# Altium schematic sheet FPGA_USB.SchDoc
size A4
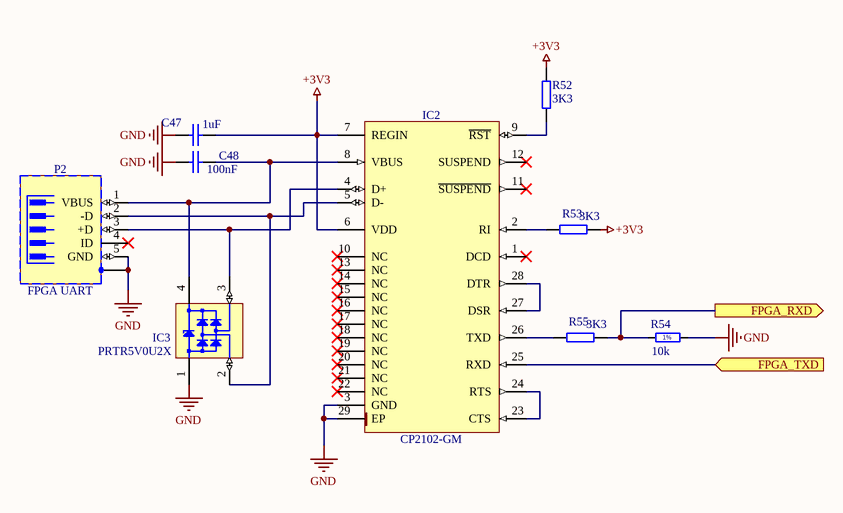
[diagram p0: FPGA_USB.SchDoc]

## Parts
C47  1uF  [CC1608-0603]
C48  100nF  [CAPC1608X87N]
IC2  CP2102-GM  [QFN50P500X500X100-29N-S335]
IC3  PRTR5V0U2X  [SOT190P230X110-4N]
P2  FPGA UART  [TYCO_1734035-1]
R52  3K3  [0603]
R53  3K3  [0603]
R54  10k  [RESC1608X55N]
R55  3K3  [0603]

## Ports
FPGA_RXD (out), FPGA_TXD (in)

## Nets
+3V3: C47.2 IC2.6(VDD) IC2.7(REGIN) R52.2 R53.2
GND: C47.1 C48.2 IC2.3(GND) IC2.29(EP) IC3.1(GND) P2.5(GND) P2.6(SH) R54.2
FPGA_RXD: R54.1 R55.2 ; port FPGA_RXD
FPGA_TXD: IC2.25(RXD) ; port FPGA_TXD
NetC48_1: C48.1 IC2.8(VBUS) IC3.4(VCC) P2.1(VBUS)
NetIC2_2: IC2.2(RI) R53.1
NetIC2_4: IC2.4(D+) IC3.3(I/O2) P2.3(+D)
NetIC2_5: IC2.5(D-) IC3.2(I/O1) P2.2(-D)
NetIC2_9: IC2.9(~{RST}) R52.1
NetIC2_23: IC2.23(CTS) IC2.24(RTS)
NetIC2_26: IC2.26(TXD) R55.1
NetIC2_27: IC2.27(DSR) IC2.28(DTR)

Not connected (* = marked no-connect by the designer): IC2 1(DCD)* 10(NC)* 11(~{SUSPEND})* 12(SUSPEND)* 13(NC)* 14(NC)* 15(NC)* 16(NC)* 17(NC)* 18(NC)* 19(NC)* 20(NC)* 21(NC)* 22(NC)*; P2 4(ID)*

## Notes on the sheet
- (in symbol R0603_10K_1%_0.1W_100PPM) 1%

## Library data of the parts
C47 = CC0603_1UF_25V_10%_X5R: Capacitor; Manufacturer1: Phycomp; Manufacturer1 PN: GRM188R61E105KA12D; TC: X5R; Tolerance: ±10%; Voltage: 25V; Published: 8-Jun-2000; LatestRevisionDate: 17-Jul-2002; LatestRevisionNote: Re-released for DXP Platform.; Publisher: Altium Limited; Distributor1: Digikey; Distributor1 PN: 490-3897-1-ND; Case: 0603; Value: 1uF
C48 = CC0603_100NF_50V_10%_X7R: Non-polarised capacitor; Part Description: SMD Multilayer Chip Ceramic Capacitor; Manufacturer: GENERIC; Manufacturer1 Part Number: 223858615649; Voltage: 50V; TC: X7R; Tolerance: ±10%; Table: Capacitors SMD; Part Number: CC0603_100NF_50V_10%_X7R; Component Kind: Standard; Component Type: Standard; Pin Count: 2; Value: 100nF; Status: Preferred; Manufacturer Part Number: CC0603_100NF_50V_10%_X7R; Case: 0603; Mounted: Yes; Socket: No; SMD: Yes; Manufacturer1 Example: PHYCOMP; Manufacturer1 ComponentHeight: 0.87mm; HelpURL: \\cern.ch\dfs\Applications\Altium\Datasheets\CC0603_X7R_PHYCOMP.pdf; Author: CERN DEM JLC; CreateDate: 03/12/2007; LatestRevisionDate: 03/12/2007
IC2 = CP2102-GM: Single-Chip USB to UART Bridge; Manufacturer: SILICON LABS; Table: Analog & Interface; Part Number: CP2102-GM; Component Kind: Standard; Component Type: Standard; Device: CP2102-GM; PackageDescription: QFN, 0.50mm Pitch, Square; 28 pin, 5.00mm L X 5.00mm W X 1.00mm H body (w/thermal tab 3.35 X 3.35mm),  IPC Medium Density; Part Description: Single-Chip USB to UART Bridge; Manufacturer Part Number: CP2102-GM; Pin Count: 29; Case: QFN28; Mounted: Yes; Socket: No; SMD: Yes; ComponentHeight: 1.0mm; Author: CERN DEM JLC; HelpURL: \\cern.ch\dfs\Applications\Altium\Datasheets\CP2102-GM.pdf; CreateDate: 3/3/2011; LatestRevisionDate: 3/3/2011
IC3 = PRTR5V0U2X: Ultra Low Capacitance Double Rail-to-Rail ESD Protection Diode; Part Description: Ultra Low Capacitance (1pF) Double Rail-to-Rail ESD Protection Diode (8kV); Manufacturer: PHILIPS NXP; Voltage: 5.5V; Table: Diodes; Part Number: PRTR5V0U2X; Component Kind: Standard; Component Type: Standard; Device: PRTR5V0U2X; PackageDescription: SOT143B, SOT, 1.90mm Pitch; 4 Pin, 1.30mm W X 2.90mm L X 1.10mm H body, IPC Medium Density; Manufacturer Part Number: PRTR5V0U2X; Pin Count: 4; Case: SOT143B; Mounted: Yes; Socket: No; SMD: Yes; ComponentHeight: 1.1mm; HelpURL: \\cern.ch\dfs\Applications\Altium\Datasheets\PRTR5V0U2X.pdf; Author: CERN DEM JLC; CreateDate: 3/22/2011; LatestRevisionDate: 3/22/2011
P2 = TYCO_1734035-1: 5 Pin + 1 Shield Mini USB Type B Receptacle; Part Description: 5 Position, Right Angle, SMD Mini USB Type B Receptacle; Manufacturer: TYCO ELECTRONICS; Table: TYCO; Part Number: TYCO_1734035-1; Component Kind: Standard; Component Type: Standard; Pin Count: 6; Family: USB; Mounted: Yes; Socket: No; SMD: Yes; Status: None; Manufacturer Part Number: 1734035-1; ComponentHeight: 3.95mm; HelpURL: \\cern.ch\dfs\Applications\Altium\Datasheets\TYCO_1734035-1.pdf; Author: CERN DEM JLC; CreateDate: 02/05/2011; LatestRevisionDate: 02/05/2011
R52 R53 R55 = R0603_3K3_±1%_0.1W_100PPM: SMD Resistor; Manufacturer1: Yageo; Manufacturer1 PN: RC0603FR-073K3L; TCR: 100ppm; Power Rating: 0.1W; Tolerance: ±1%; Case: 0603; Distributor1: DigiKey; Distributor1 PN: 311-3.30KHRCT-ND; Value: 3K3
R54 = R0603_10K_1%_0.1W_100PPM: Resistor - 1%; Part Description: General Purpose Thick Film Chip Resistor; Manufacturer: GENERIC; Manufacturer1 Part Number: NRC06F1002TRF; Power: 0.1W; TC: ±100ppm/°C; Table: Resistors SMD; Part Number: R0603_10K_1%_0.1W_100PPM; Component Kind: Standard; Component Type: Standard; Pin Count: 2; Value: 10k; Status: Preferred; Tolerance: ±1%; Manufacturer Part Number: R0603_10K_1%_0.1W_100PPM; Case: 0603; Mounted: Yes; Socket: No; SMD: Yes; Manufacturer1 Example: NIC COMPONENT; Manufacturer1 ComponentHeight: 0.55mm; HelpURL: \\cern.ch\dfs\Applications\Altium\Datasheets\R0603_NIC_NRC.pdf; Author: CERN DEM JLC; CreateDate: 12/3/2007; LatestRevisionDate: 3/13/2008